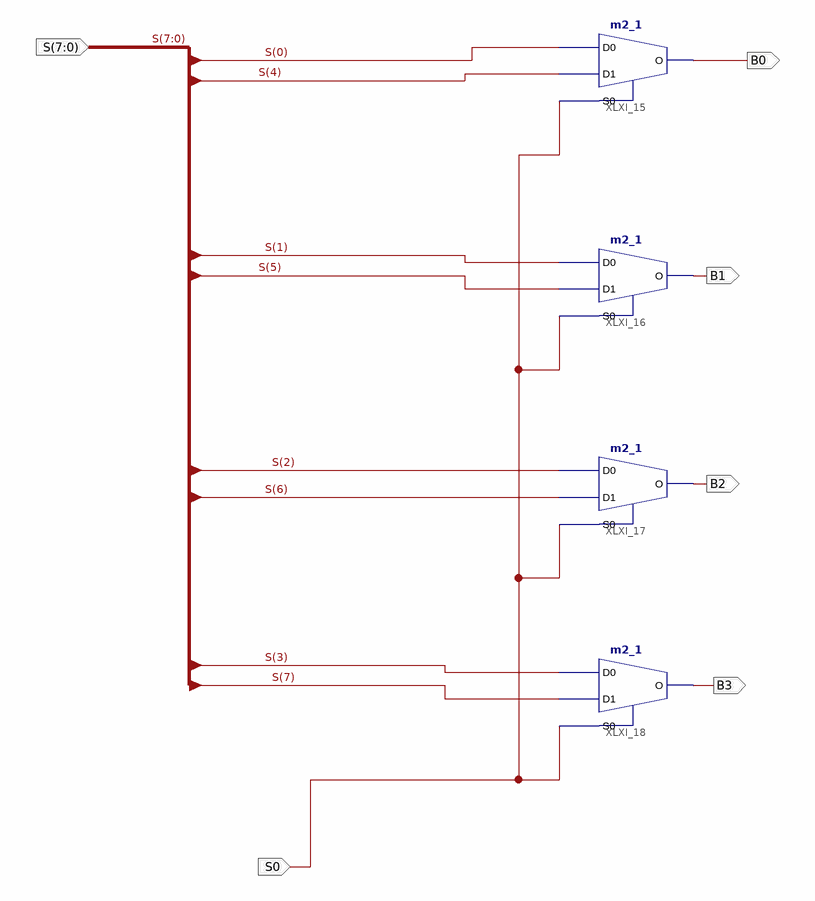
[diagram p0: schematic sheet 1]
// Xilinx ISE schematic M8_4.sch (spartan6) as structural Verilog: 4 symbols, 6 ports
module M8_4 (
  input  S0,
  input  [7:0] S,
  output B0,
  output B1,
  output B2,
  output B3
);

  m2_1 XLXI_15 (.D0(S[0]), .D1(S[4]), .S0(S0), .O(B0));
  m2_1 XLXI_16 (.D0(S[1]), .D1(S[5]), .S0(S0), .O(B1));
  m2_1 XLXI_17 (.D0(S[2]), .D1(S[6]), .S0(S0), .O(B2));
  m2_1 XLXI_18 (.D0(S[3]), .D1(S[7]), .S0(S0), .O(B3));
endmodule
